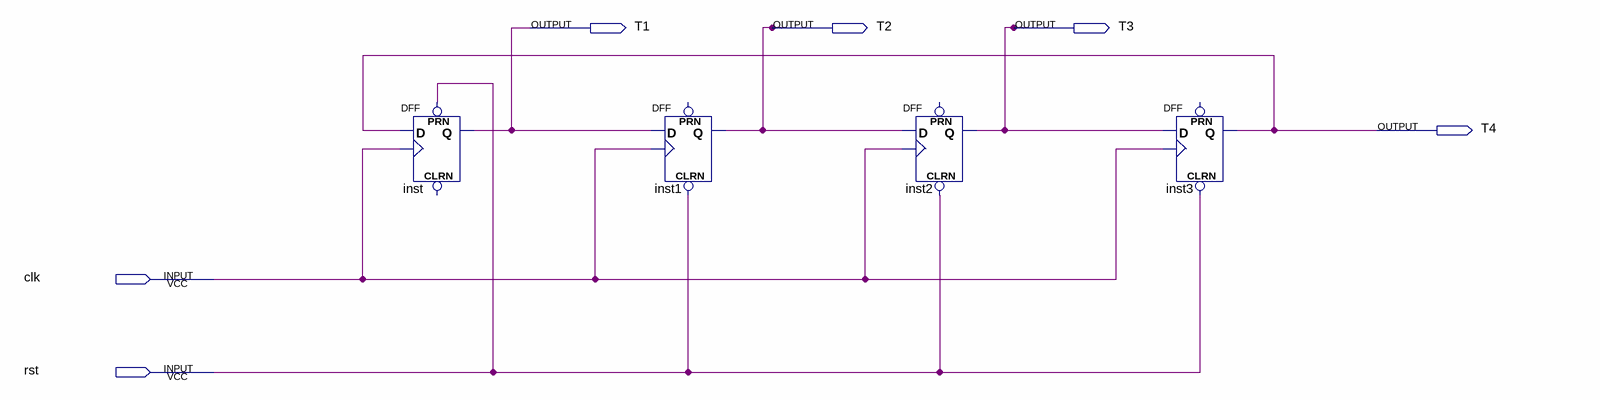
[diagram p0: schematic sheet]
// Quartus schematic 11.bdf as structural Verilog: 4 symbols, 6 pins
module \11  (
  input  clk,
  input  rst,
  output T1,
  output T2,
  output T3,
  output T4
);

  DFF inst (.CLK(clk), .D(T4), .PRN(rst), .Q(T1));  // open: CLRN
  DFF inst1 (.CLRN(rst), .CLK(clk), .D(T1), .Q(T2));  // open: PRN
  DFF inst2 (.CLRN(rst), .CLK(clk), .D(T2), .Q(T3));  // open: PRN
  DFF inst3 (.CLRN(rst), .CLK(clk), .D(T3), .Q(T4));  // open: PRN
endmodule
